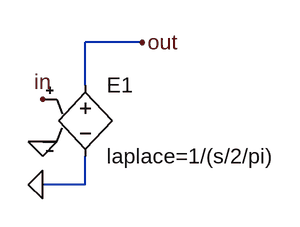
[diagram p0: schematic integ.asc]
integ.asc, the LTspice schematic file:
Version 4
SHEET 1 880 680
WIRE 304 64 240 64
WIRE 240 112 240 64
WIRE 240 224 240 192
WIRE 240 224 192 224
FLAG 192 128 in
FLAG 192 224 0
FLAG 304 64 out
FLAG 192 176 0
SYMBOL e 240 96 R0
SYMATTR InstName E1
SYMATTR Value laplace=1/(s/2/pi)

The netlist it stands for:
* integ.asc
E1 out 0 in 0 laplace=1/(s/2/pi)
.backanno
.end